# Altium schematic sheet Ethernet_RTL8201CL.SchDoc: Ethernet Interface
size A3; Revision: 5; SheetNumber: 5; SheetTotal: 8; Organization: Altium Limited.; Address1: Level 3, 12a Rodborough Rd; Address2: Frenchs Forest 2086; Address3: NSW; Address4: AUSTRALIA
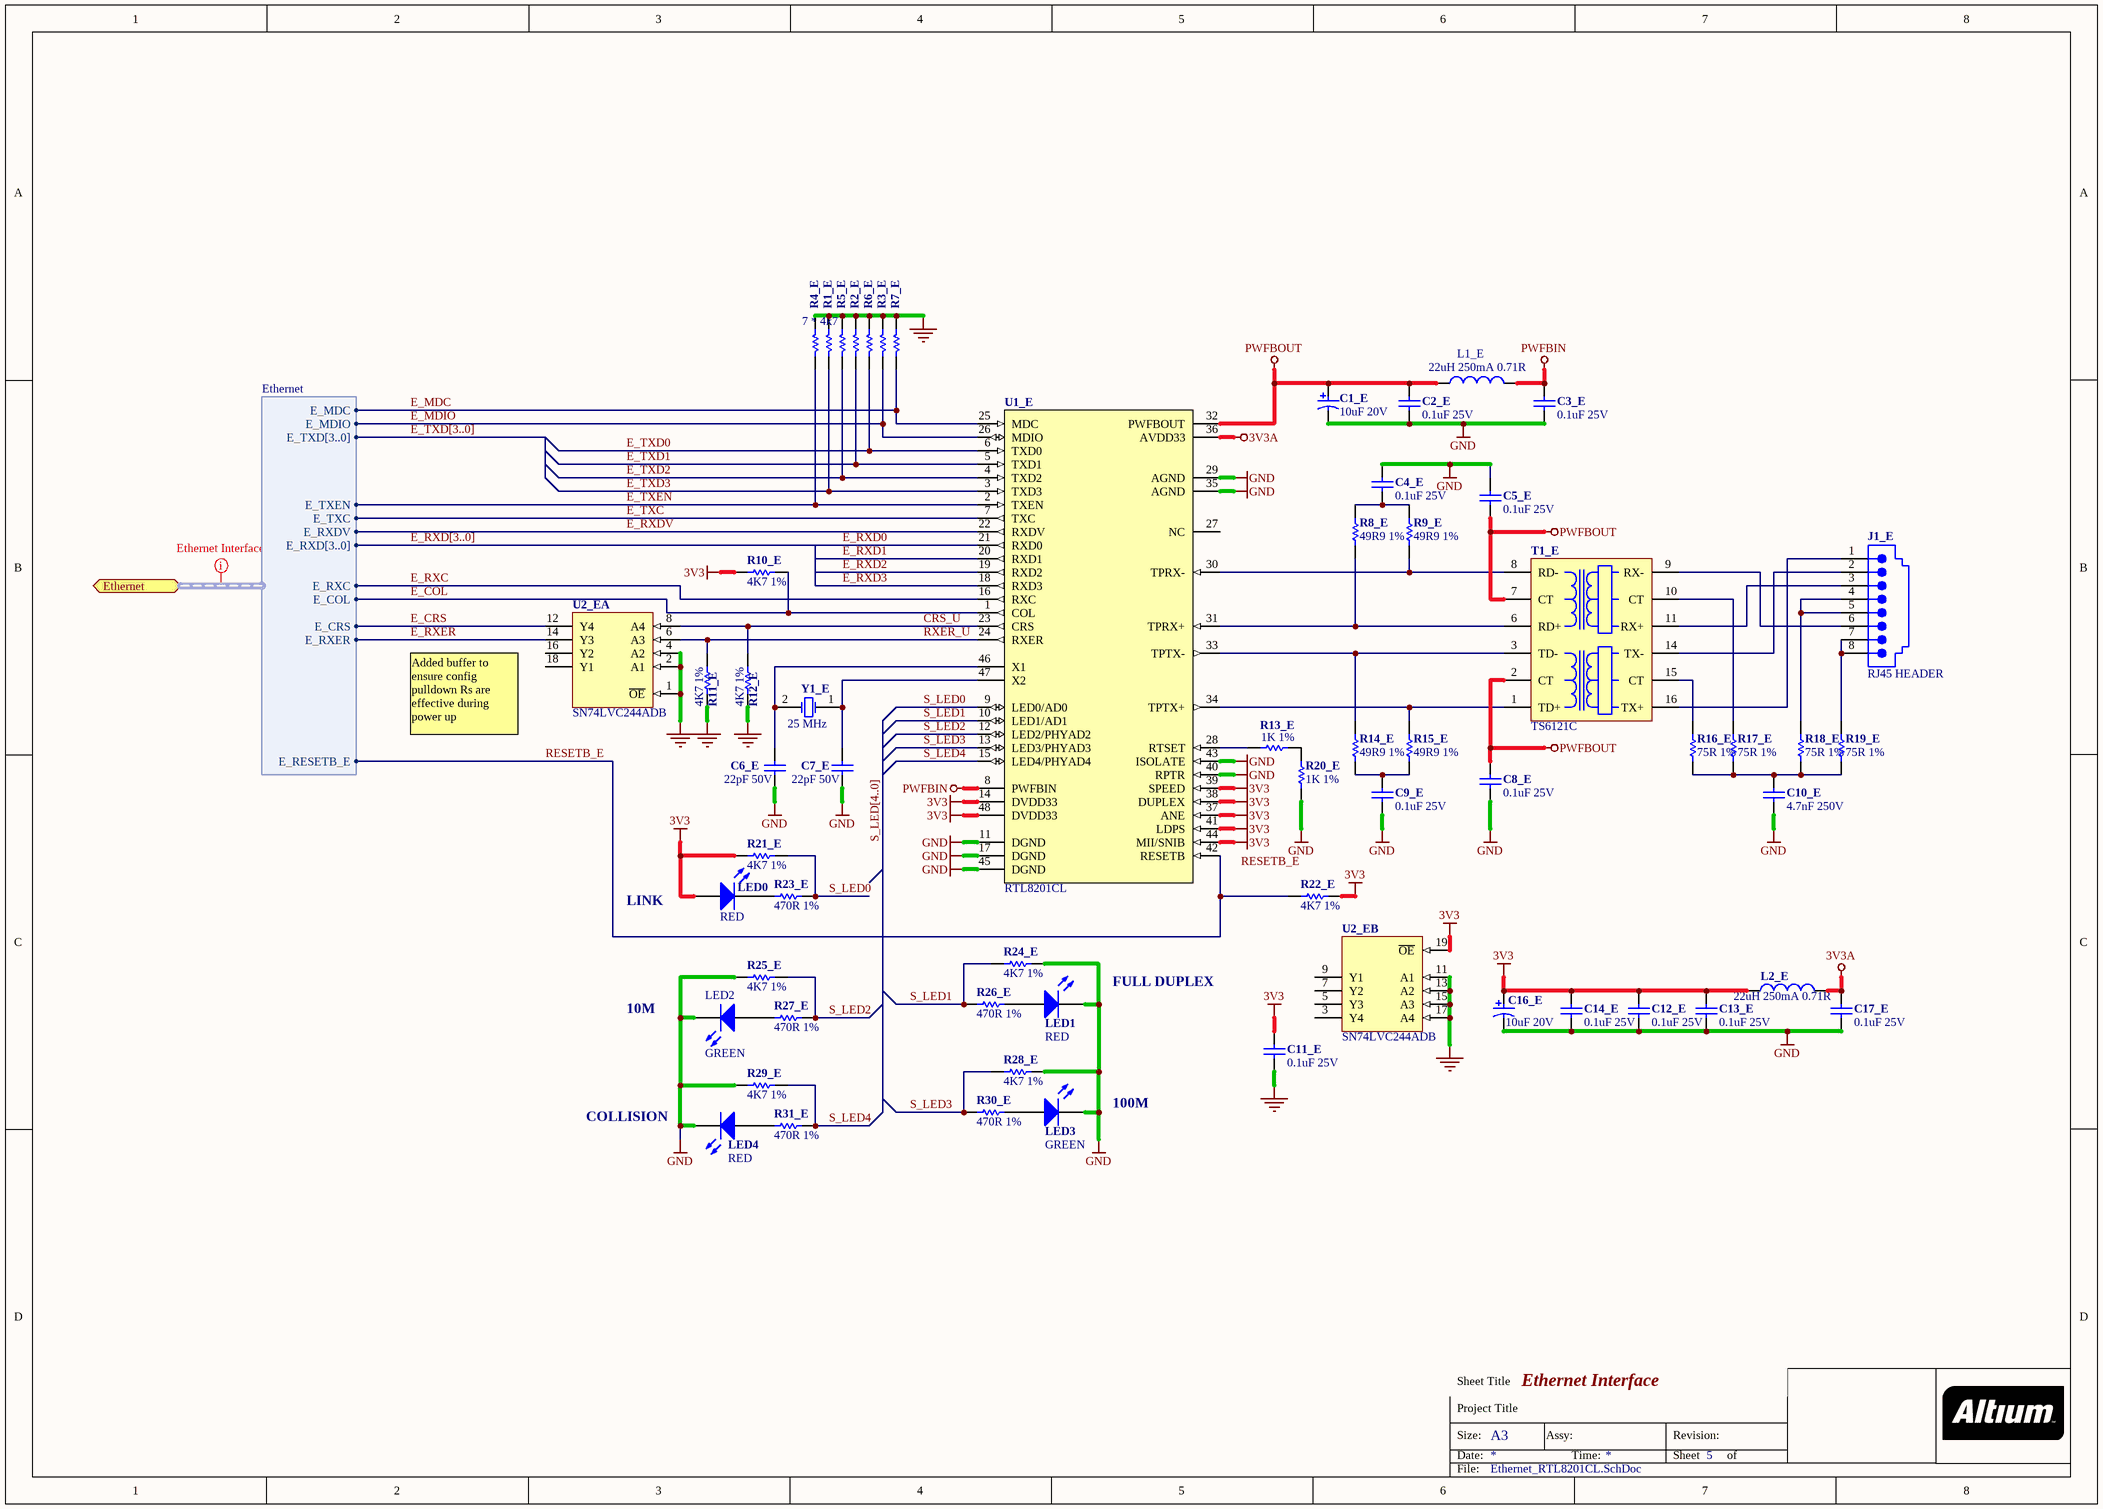
[diagram p0: Ethernet_RTL8201CL.SchDoc]

## Parts
C1_E  10uF 20V  [CAPC3528-STAR]
C2_E  0.1uF 25V  [CAPC1005-STAR]
C3_E  0.1uF 25V  [CAPC1005-STAR]
C4_E  0.1uF 25V  [CAPC1005-STAR]
C5_E  0.1uF 25V  [CAPC1005-STAR]
C6_E  22pF 50V  [CAPC1005-STAR]
C7_E  22pF 50V  [CAPC1005-STAR]
C8_E  0.1uF 25V  [CAPC1005-STAR]
C9_E  0.1uF 25V  [CAPC1005-STAR]
C10_E  4.7nF 250V  [CAPM7163]
C11_E  0.1uF 25V  [CAPC1005-STAR]
C12_E  0.1uF 25V  [CAPC1005-STAR]
C13_E  0.1uF 25V  [CAPC1005-STAR]
C14_E  0.1uF 25V  [CAPC1005-STAR]
C16_E  10uF 20V  [CAPC3528-STAR]
C17_E  0.1uF 25V  [CAPC1005-STAR]
J1_E  RJ45 HEADER  [15-43-6233]
L1_E  22uH 250mA 0.71R  [INDC3225]
L2_E  22uH 250mA 0.71R  [INDC3225]
LED0  RED  [LED2012-STAR]
LED1  RED  [LED2012-STAR]
LED2  GREEN  [LED2012-STAR]
LED3  GREEN  [LED2012-STAR]
LED4  RED  [LED2012-STAR]
R1_E  4K7 1%  [RESC1005-STAR]  (value not drawn)
R2_E  4K7 1%  [RESC1005-STAR]  (value not drawn)
R3_E  4K7 1%  [RESC1005-STAR]  (value not drawn)
R4_E  4K7 1%  [RESC1005-STAR]  (value not drawn)
R5_E  4K7 1%  [RESC1005-STAR]  (value not drawn)
R6_E  4K7 1%  [RESC1005-STAR]  (value not drawn)
R7_E  4K7 1%  [RESC1005-STAR]  (value not drawn)
R8_E  49R9 1%  [RESC2012-STAR]
R9_E  49R9 1%  [RESC2012-STAR]
R10_E  4K7 1%  [RESC1005-STAR]
R11_E  4K7 1%  [RESC1005-STAR]
R12_E  4K7 1%  [RESC1005-STAR]
R13_E  1K 1%  [RESC1005-STAR]
R14_E  49R9 1%  [RESC2012-STAR]
R15_E  49R9 1%  [RESC2012-STAR]
R16_E  75R 1%  [RESC1005-STAR]
R17_E  75R 1%  [RESC1005-STAR]
R18_E  75R 1%  [RESC1005-STAR]
R19_E  75R 1%  [RESC1005-STAR]
R20_E  1K 1%  [RESC1005-STAR]
R21_E  4K7 1%  [RESC1005-STAR]
R22_E  4K7 1%  [RESC1005-STAR]
R23_E  470R 1%  [RESC1005-STAR]
R24_E  4K7 1%  [RESC1005-STAR]
R25_E  4K7 1%  [RESC1005-STAR]
R26_E  470R 1%  [RESC1005-STAR]
R27_E  470R 1%  [RESC1005-STAR]
R28_E  4K7 1%  [RESC1005-STAR]
R29_E  4K7 1%  [RESC1005-STAR]
R30_E  470R 1%  [RESC1005-STAR]
R31_E  470R 1%  [RESC1005-STAR]
T1_E  TS6121C  [SOIC127P910-16-TX]
U1_E  RTL8201CL  [TSQFP50P900X900-48]
U2_E  SN74LVC244ADB  [SOP65P780-20]  (parts A,B of 2)
Y1_E  25 MHz  [XTAL_HC49SMD]

## Ports
Ethernet (harness Ethernet)

## Harnesses
Ethernet: E_MDC, E_MDIO, E_TXD[3..0], E_TXC, E_TXEN, E_RXDV, E_RXD[3..0], E_RESETB_E, E_RXC, E_COL, E_CRS, E_RXER

## Nets
3V3: C11_E.2 C12_E.2 C13_E.2 C14_E.2 C16_E.1 L2_E.1 LED0.1(A) R10_E.2 R21_E.2 R22_E.2 U1_E.14(DVDD33) U1_E.37(ANE) U1_E.38(DUPLEX) U1_E.39(SPEED) U1_E.41(LDPS) U1_E.44(MII/SNIB) U1_E.48(DVDD33) U2_E.19(~{OE}) U2_E.20(VCC)
3V3A: C17_E.2 L2_E.2 U1_E.36(AVDD33)
GND: C1_E.2 C2_E.1 C3_E.1 C4_E.2 C5_E.2 C6_E.1 C7_E.1 C8_E.1 C9_E.1 C10_E.1 C11_E.1 C12_E.1 C13_E.1 C14_E.1 C16_E.2 C17_E.1 LED1.2(K) LED2.2(K) LED3.2(K) LED4.2(K) R1_E.2 R2_E.2 R3_E.2 R4_E.2 R5_E.2 R6_E.2 R7_E.2 R11_E.2 R12_E.2 R20_E.1 R24_E.1 R25_E.2 R28_E.1 R29_E.2 U1_E.11(DGND) U1_E.17(DGND) U1_E.29(AGND) U1_E.35(AGND) U1_E.40(RPTR) U1_E.43(ISOLATE) U1_E.45(DGND) U2_E.1(~{OE}) U2_E.2(A1) U2_E.4(A2) U2_E.10(GND) U2_E.11(A1) U2_E.13(A2) U2_E.15(A3) U2_E.17(A4)
PWFBIN: C3_E.2 L1_E.2 U1_E.8(PWFBIN)
PWFBOUT: C1_E.1 C2_E.2 C5_E.1 C8_E.2 L1_E.1 T1_E.2(CT) T1_E.7(CT) U1_E.32(PWFBOUT)
CRS_U: R12_E.1 U1_E.23(CRS) U2_E.8(A4)
E_COL: R10_E.1 U1_E.1(COL) ; port Ethernet.E_COL
E_CRS: U2_E.12(Y4) ; port Ethernet.E_CRS
E_MDC: R7_E.1 U1_E.25(MDC) ; port Ethernet.E_MDC
E_MDIO: R3_E.1 U1_E.26(MDIO) ; port Ethernet.E_MDIO
E_RXC: U1_E.16(RXC) ; port Ethernet.E_RXC
E_RXD0: U1_E.21(RXD0)
E_RXD1: U1_E.20(RXD1)
E_RXD2: U1_E.19(RXD2)
E_RXD3: U1_E.18(RXD3)
E_RXDV: U1_E.22(RXDV) ; port Ethernet.E_RXDV
E_RXER: U2_E.14(Y3) ; port Ethernet.E_RXER
E_TXC: U1_E.7(TXC) ; port Ethernet.E_TXC
E_TXD0: R6_E.1 U1_E.6(TXD0)
E_TXD1: R2_E.1 U1_E.5(TXD1)
E_TXD2: R5_E.1 U1_E.4(TXD2)
E_TXD3: R1_E.1 U1_E.3(TXD3)
E_TXEN: R4_E.1 U1_E.2(TXEN) ; port Ethernet.E_TXEN
RESETB_E: R22_E.1 U1_E.42(RESETB) ; port Ethernet.E_RESETB_E
RXER_U: R11_E.1 U1_E.24(RXER) U2_E.6(A3)
S_LED0: R21_E.1 R23_E.1 U1_E.9(LED0/AD0)
S_LED1: R24_E.2 R26_E.1 U1_E.10(LED1/AD1)
S_LED2: R25_E.1 R27_E.1 U1_E.12(LED2/PHYAD2)
S_LED3: R28_E.2 R30_E.1 U1_E.13(LED3/PHYAD3)
S_LED4: R29_E.1 R31_E.1 U1_E.15(LED4/PHYAD4)
NetC4_E_1: C4_E.1 R8_E.2 R9_E.2
NetC6_E_2: C6_E.2 U1_E.46(X1) Y1_E.2(OSC2)
NetC7_E_2: C7_E.2 U1_E.47(X2) Y1_E.1(OSC1)
NetC9_E_2: C9_E.2 R14_E.1 R15_E.1
NetC10_E_2: C10_E.2 R16_E.1 R17_E.1 R18_E.1 R19_E.1
NetJ1_E_1: J1_E.1 T1_E.16(TX+)
NetJ1_E_2: J1_E.2 T1_E.14(TX-)
NetJ1_E_3: J1_E.3 T1_E.11(RX+)
NetJ1_E_4: J1_E.4 J1_E.5 R18_E.2
NetJ1_E_6: J1_E.6 T1_E.9(RX-)
NetJ1_E_7: J1_E.7 J1_E.8 R19_E.2
NetLED0_2: LED0.2(K) R23_E.2
NetLED1_1: LED1.1(A) R26_E.2
NetLED2_1: LED2.1(A) R27_E.2
NetLED3_1: LED3.1(A) R30_E.2
NetLED4_1: LED4.1(A) R31_E.2
NetR8_E_1: R8_E.1 T1_E.6(RD+) U1_E.31(TPRX+)
NetR9_E_1: R9_E.1 T1_E.8(RD-) U1_E.30(TPRX-)
NetR13_E_1: R13_E.1 R20_E.2
NetR13_E_2: R13_E.2 U1_E.28(RTSET)
NetR14_E_2: R14_E.2 T1_E.3(TD-) U1_E.33(TPTX-)
NetR15_E_2: R15_E.2 T1_E.1(TD+) U1_E.34(TPTX+)
NetR16_E_2: R16_E.2 T1_E.15(CT)
NetR17_E_2: R17_E.2 T1_E.10(CT)

Not connected (* = marked no-connect by the designer): U1_E 27(NC); U2_E 3(Y4) 5(Y3) 7(Y2) 9(Y1) 16(Y2) 18(Y1)

## Buses and harness runs
bus E_RXD[3..0]
bus E_TXD[3..0]
bus S_LED[4..0]

## Layout directives
net class Ethernet Interface: (no net found under the mark)

## Notes on the sheet
- (near R4_E) 7 * 4k7
- Added buffer to ensure config pulldown Rs are effective during power up
- LINK
- FULL DUPLEX
- 10M
- COLLISION
- 100M
- Labels drawn without touching a wire or pin: RESETB_E
- Sheet Title
- Project Title
- Size:
- Date:
- A3
- Assy:
- Time:
- Revision:
- Sheet
- of
- File:

## Library data of the parts
C1_E C16_E = D-101-0007: Capacitor, Tantalum, 10uF 10% 20V MCCT-B (3528); Polarity: Polarized; Capacitance: 10 uF; Category: Capacitor; Mounting Technology: Surface Mount; Rated Voltage: 20 V; Status: Production; Technology: Tantalum; Tolerance: 10 %
C2_E C3_E C4_E C5_E C8_E C9_E C11_E C12_E C13_E C14_E C17_E = D-101-0045: Capacitor, Ceramic, 0.1uF 25V 0402 (1005); Dielectric: X7R; Polarity: Non-Polarized; Tolerance: 10 %; Capacitance: 0.1 uF; Category: Capacitor; Mounting Technology: Surface Mount; Rated Voltage: 25 V; Status: Deprecated; Technology: Ceramic
C6_E C7_E = D-101-0059: Capacitor, Ceramic, 22pF 5% 50V 0402 (1005) COG; Polarity: Non-Polarized; Capacitance: 22 pF; Category: Capacitor; Dielectric: COG; Mounting Technology: Surface Mount; Rated Voltage: 50 V; Status: Unreleased; Technology: Ceramic; Tolerance: 5 %
C10_E = D-101-0019: Capacitor, Ceramic, 4.7nF 20% 250V Panasonic BC J Lead (CAPM7163) Y5V; Polarity: Non-Polarized; Tolerance: 20% %; Capacitance: 4.7 nF; Category: Capacitor; Dielectric: Y5V; Mounting Technology: Surface Mount; Rated Voltage: 250 V; Status: Production; Technology: Ceramic
J1_E = D-300-0005: Connector, RJ45 Socket, Right-Angle, 8 Way (Ethernet), PCM8P8C; Category: Connector; Connector type: RJ45 HEADER; Status: Production
L1_E L2_E = D-102-0006: Inductor, Coil 22uH  1210 (3225) LQH32CN220K21L; Max Input Current: mA; Category: Inductor; Inductance: 22 uH; Mounting Technology: Surface Mount; Status: Production
LED0 LED1 LED4 = D-153-0003: LED, Red 0805 (2013) HSMH-C170; Brightness: 17.0 mcd; Peak Wave Length: 639 nm; Category: LED; Color: N/A; Mounting Technology: Surface Mount; Status: Production
LED2 LED3 = D-153-0004: LED, Green 0805 (2012) KP-2012SGD; Brightness: 12.5 mcd; Peak Wave Length: 565 nm; Category: LED; Color: N/A; Mounting Technology: Surface Mount; Status: Production
R1_E R2_E R3_E R4_E R5_E R6_E R7_E R10_E R11_E R12_E R21_E R22_E R24_E R25_E R28_E R29_E = D-100-0088: Resistor, 4K7 1% 0402 (1005); Power Rating: 63 mW; Resistance: 4.7 K; Category: Resistor; Mounting Technology: Surface Mount; Status: Production; Tolerance: 1 %
R8_E R9_E R14_E R15_E = D-100-0017: Resistor, 49R9 1% 0805 (2012); Power Rating: mW; Resistance: 49.9 R; Category: Resistor; Mounting Technology: Surface Mount; Status: Production; Tolerance: 1 %
R13_E R20_E = D-100-0121: Resistor, 1K 1% 0402 (1005); Power Rating: 63 mW; Category: Resistor; Mounting Technology: Surface Mount; Resistance: 1 K; Status: Production; Tolerance: 1 %
R16_E R17_E R18_E R19_E = D-100-0001: Resistor, 75R 1% 0402; Power Rating: mW; Resistance: mR; Category: Resistor; Mounting Technology: Surface Mount; Status: Production; Tolerance: 1 %
R23_E R26_E R27_E R30_E R31_E = D-100-0093: Resistor, 470R 1% 0402 (1005); Power Rating: 63 mW; Category: Resistor; Mounting Technology: Surface Mount; Resistance: 470 R; Status: Production; Tolerance: 1 %
T1_E = D-107-0001: Transformer, TS6121C Ethernet 10/100; Category: Transformer; Status: Production
U1_E = D-221-0000: RTL8201CL-VD, Single-Chip/Single-Port 10/100 Fast Ethernet Phyceiver; Comm Standard: None; Category: IC-Communication; Mounting Technology: Surface Mount; Status: Production
U2_E = D-205-0000: SN74LVC244ADBR,  Octal Buffer/Driver with 3-State Outputs, 2.0V - 3.6V; Category: IC-Logic; Status: Production
Y1_E = D-103-0003: Crystal, 25 MHz  +/-30ppm 20pf HC49SMD; Frequency Stability: 30 ppm; Nominal Operational Voltage: mV; Category: Crystal; Frequency Tolerance: 30 ppm; Load Capacitance: 20 pF; Mounting Technology: Surface Mount; Nominal Fequency: 25 MHz; Status: Production